# EAGLE design Phase 3.1. Form Factor 3 (EAGLE 9.6.2)
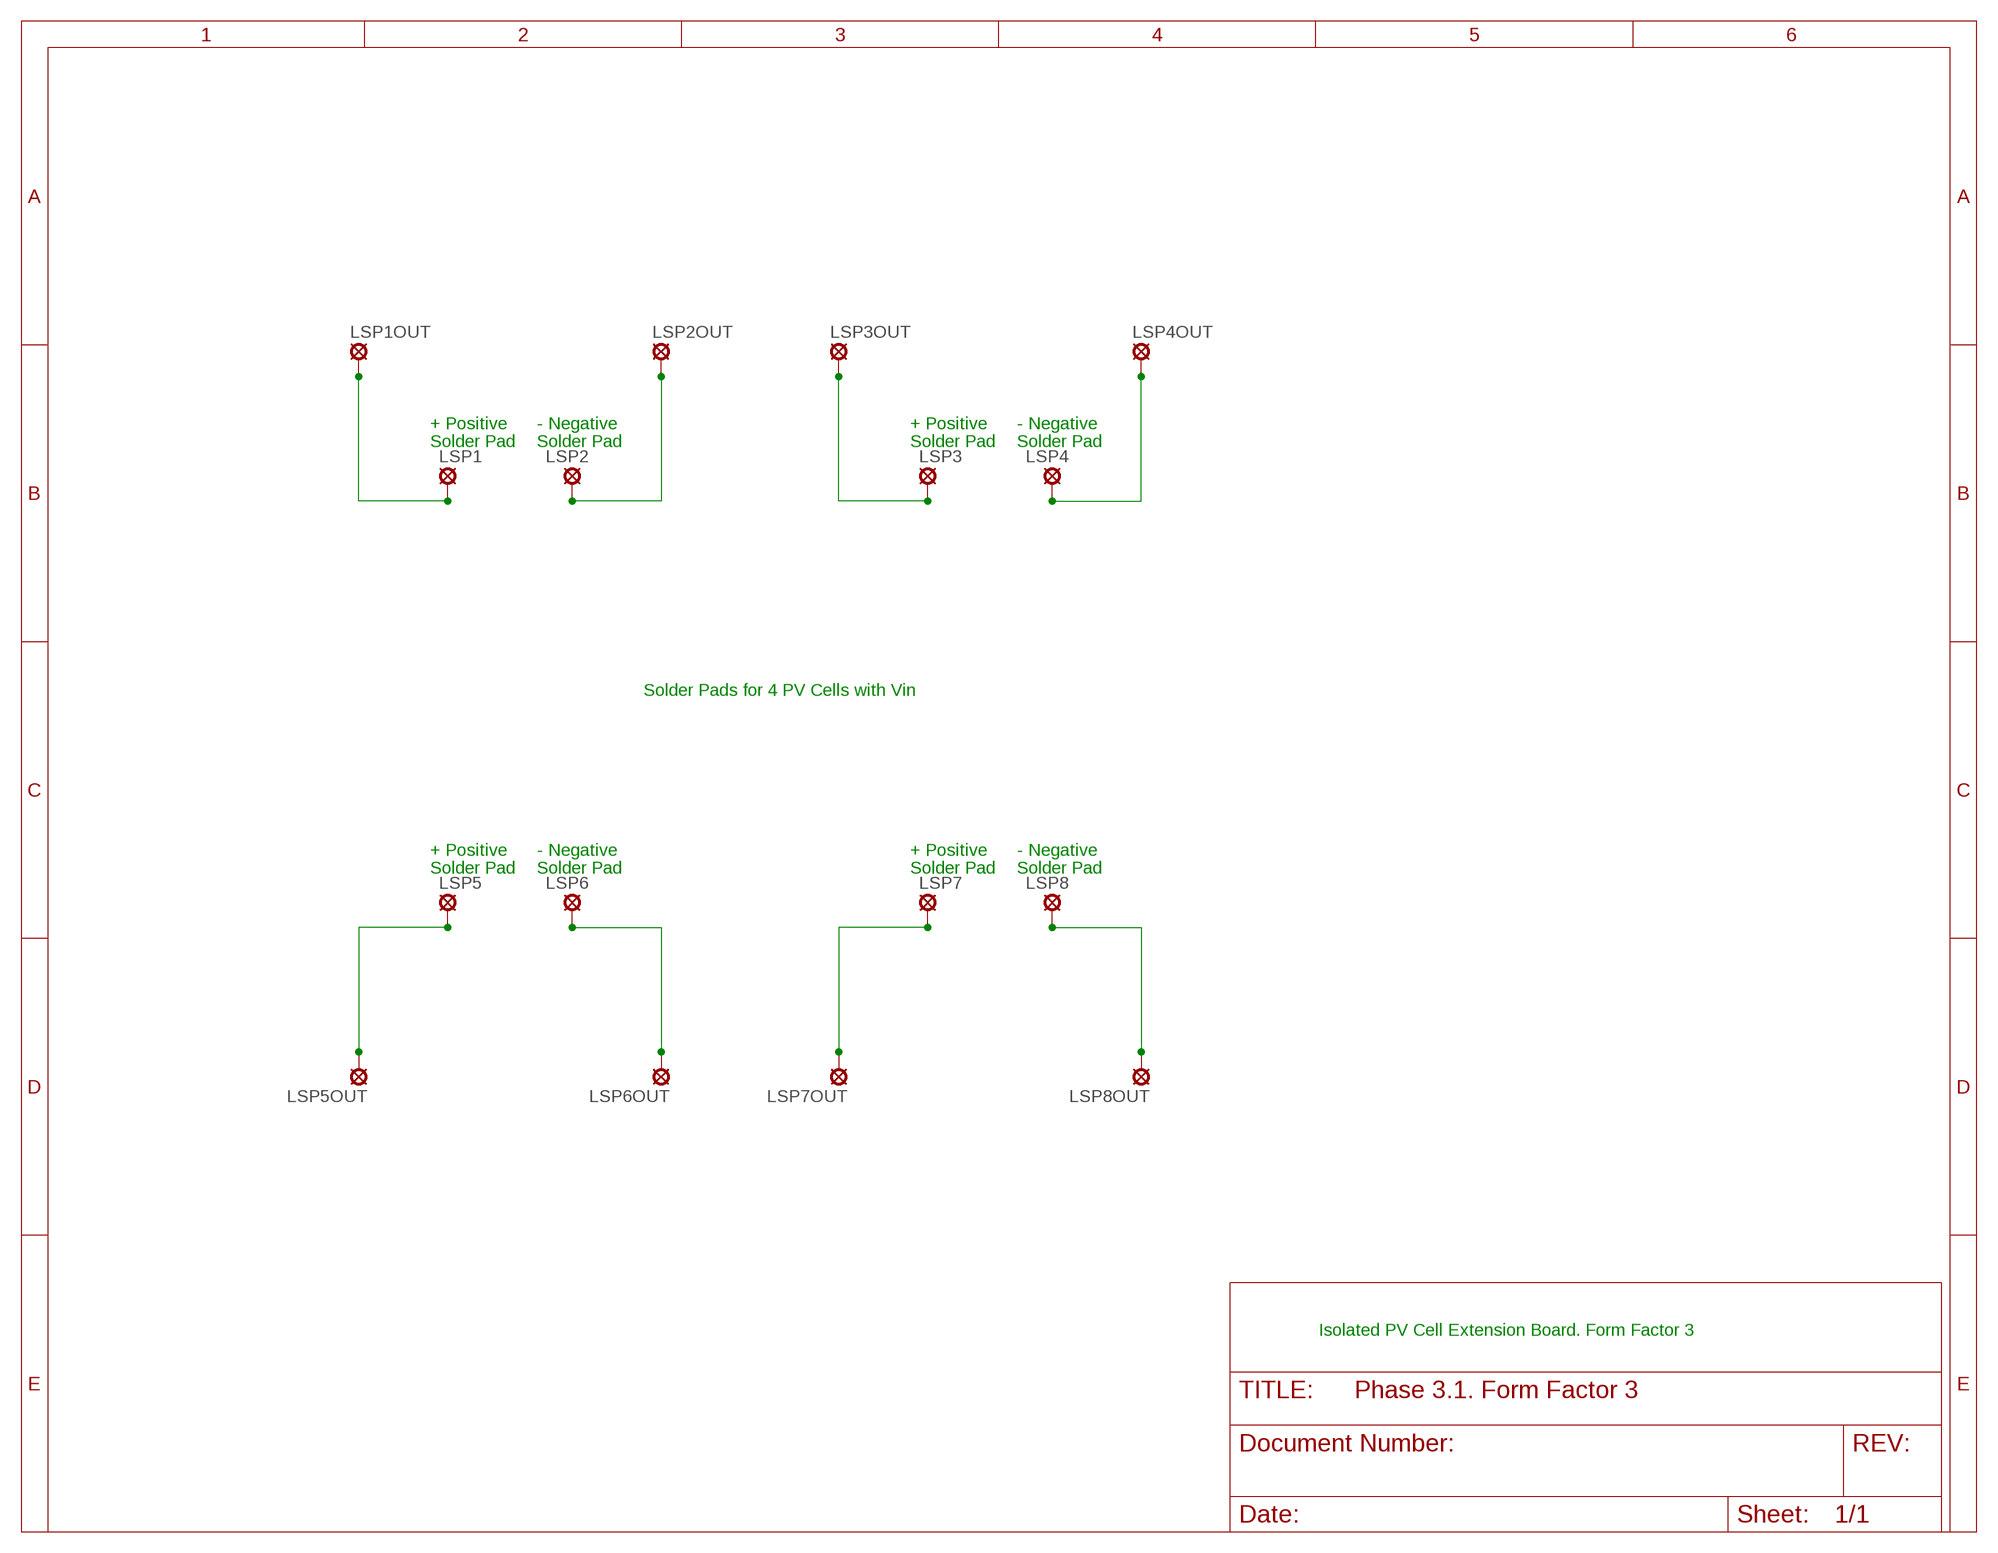
[diagram p0: schematic, sheet 1]

## Parts
LSP1  LSP10  [LSP10]
LSP1OUT  LSP10  [LSP10]
LSP2  LSP10  [LSP10]
LSP2OUT  LSP10  [LSP10]
LSP3  LSP10  [LSP10]
LSP3OUT  LSP10  [LSP10]
LSP4  LSP10  [LSP10]
LSP4OUT  LSP10  [LSP10]
LSP5  LSP10  [LSP10]
LSP5OUT  LSP10  [LSP10]
LSP6  LSP10  [LSP10]
LSP6OUT  LSP10  [LSP10]
LSP7  LSP10  [LSP10]
LSP7OUT  LSP10  [LSP10]
LSP8  LSP10  [LSP10]
LSP8OUT  LSP10  [LSP10]

## Nets
N$1: LSP1.MP LSP1OUT.MP
N$2: LSP2.MP LSP2OUT.MP
N$3: LSP3.MP LSP3OUT.MP
N$4: LSP4.MP LSP4OUT.MP
N$5: LSP5.MP LSP5OUT.MP
N$6: LSP6.MP LSP6OUT.MP
N$7: LSP7.MP LSP7OUT.MP
N$8: LSP8.MP LSP8OUT.MP

## Notes on the sheet
- + Positive | - Negative | + Positive | - Negative
- Solder Pad | Solder Pad | Solder Pad | Solder Pad
- Solder Pads for 4 PV Cells with Vin
- + Positive | - Negative | + Positive | - Negative
- Solder Pad | Solder Pad | Solder Pad | Solder Pad
- Isolated PV Cell Extension Board. Form Factor 3

## Library data of the parts
LSP1 LSP1OUT LSP2 LSP2OUT LSP3 LSP3OUT LSP4 LSP4OUT LSP5 LSP5OUT LSP6 LSP6OUT LSP7 LSP7OUT LSP8 LSP8OUT = solpad:LSP10: SOLDER PAD drill 1.0 mm, distributor Buerklin, 12H555

## Board
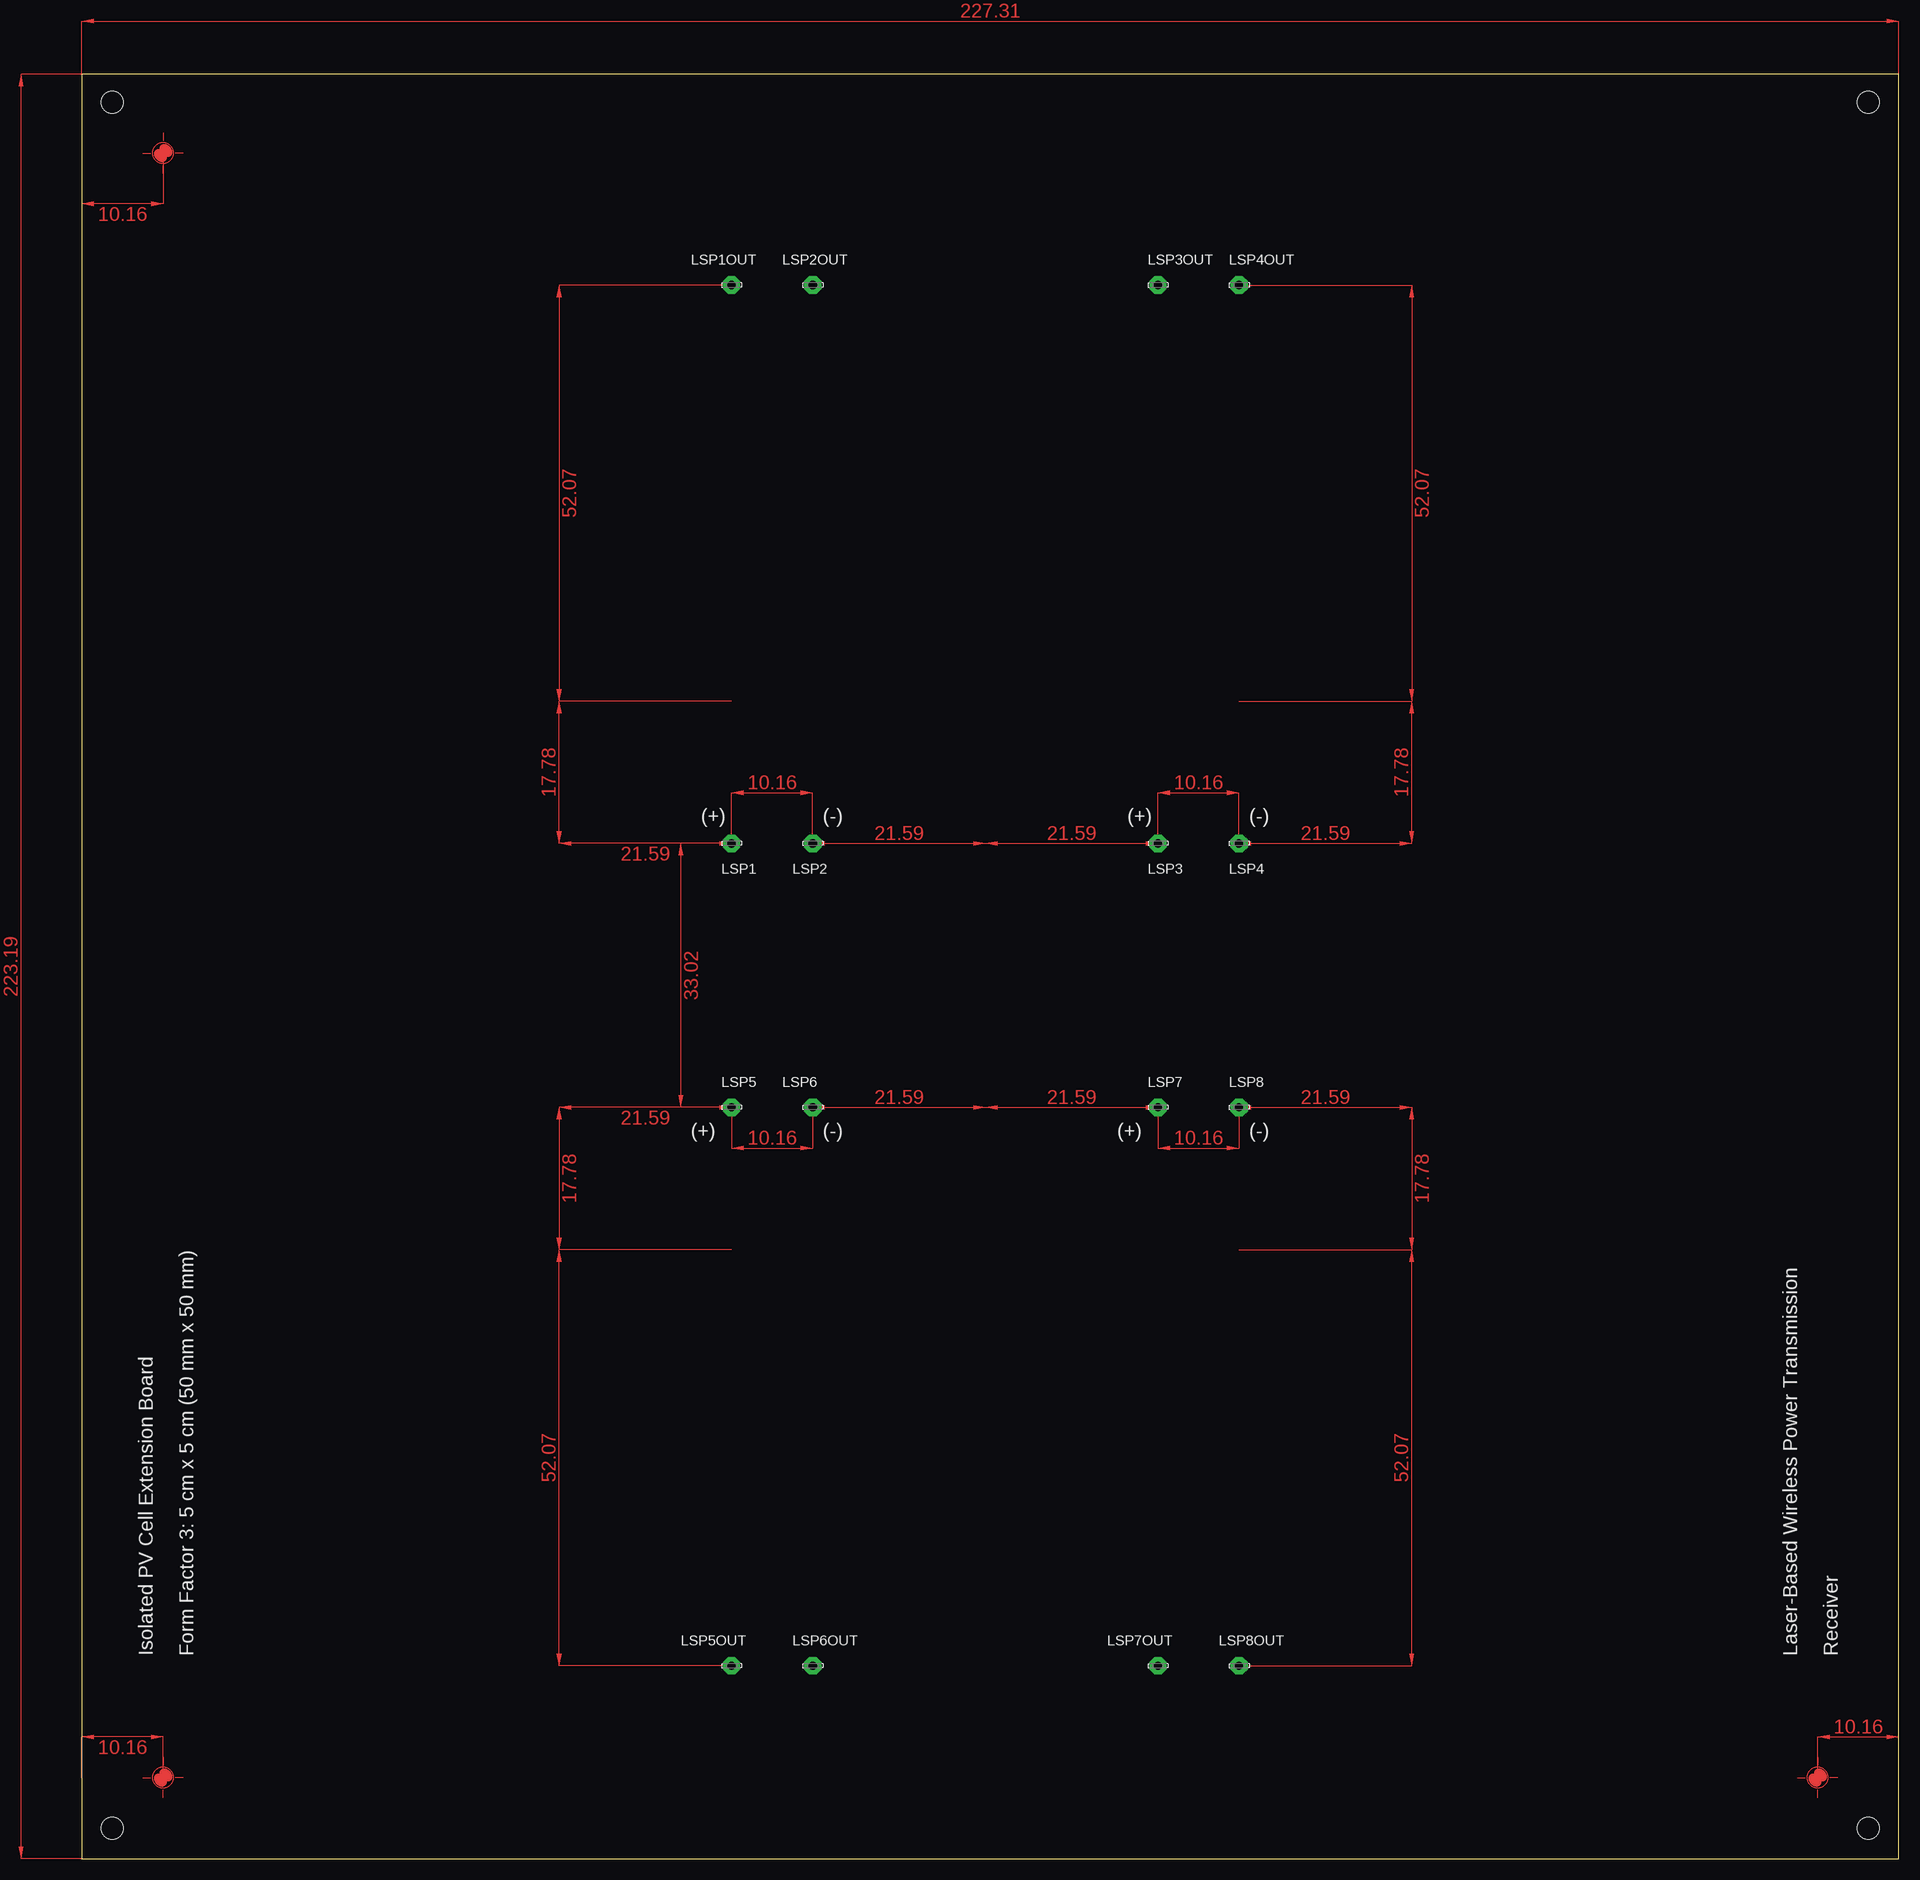
[diagram p1: board, top side]
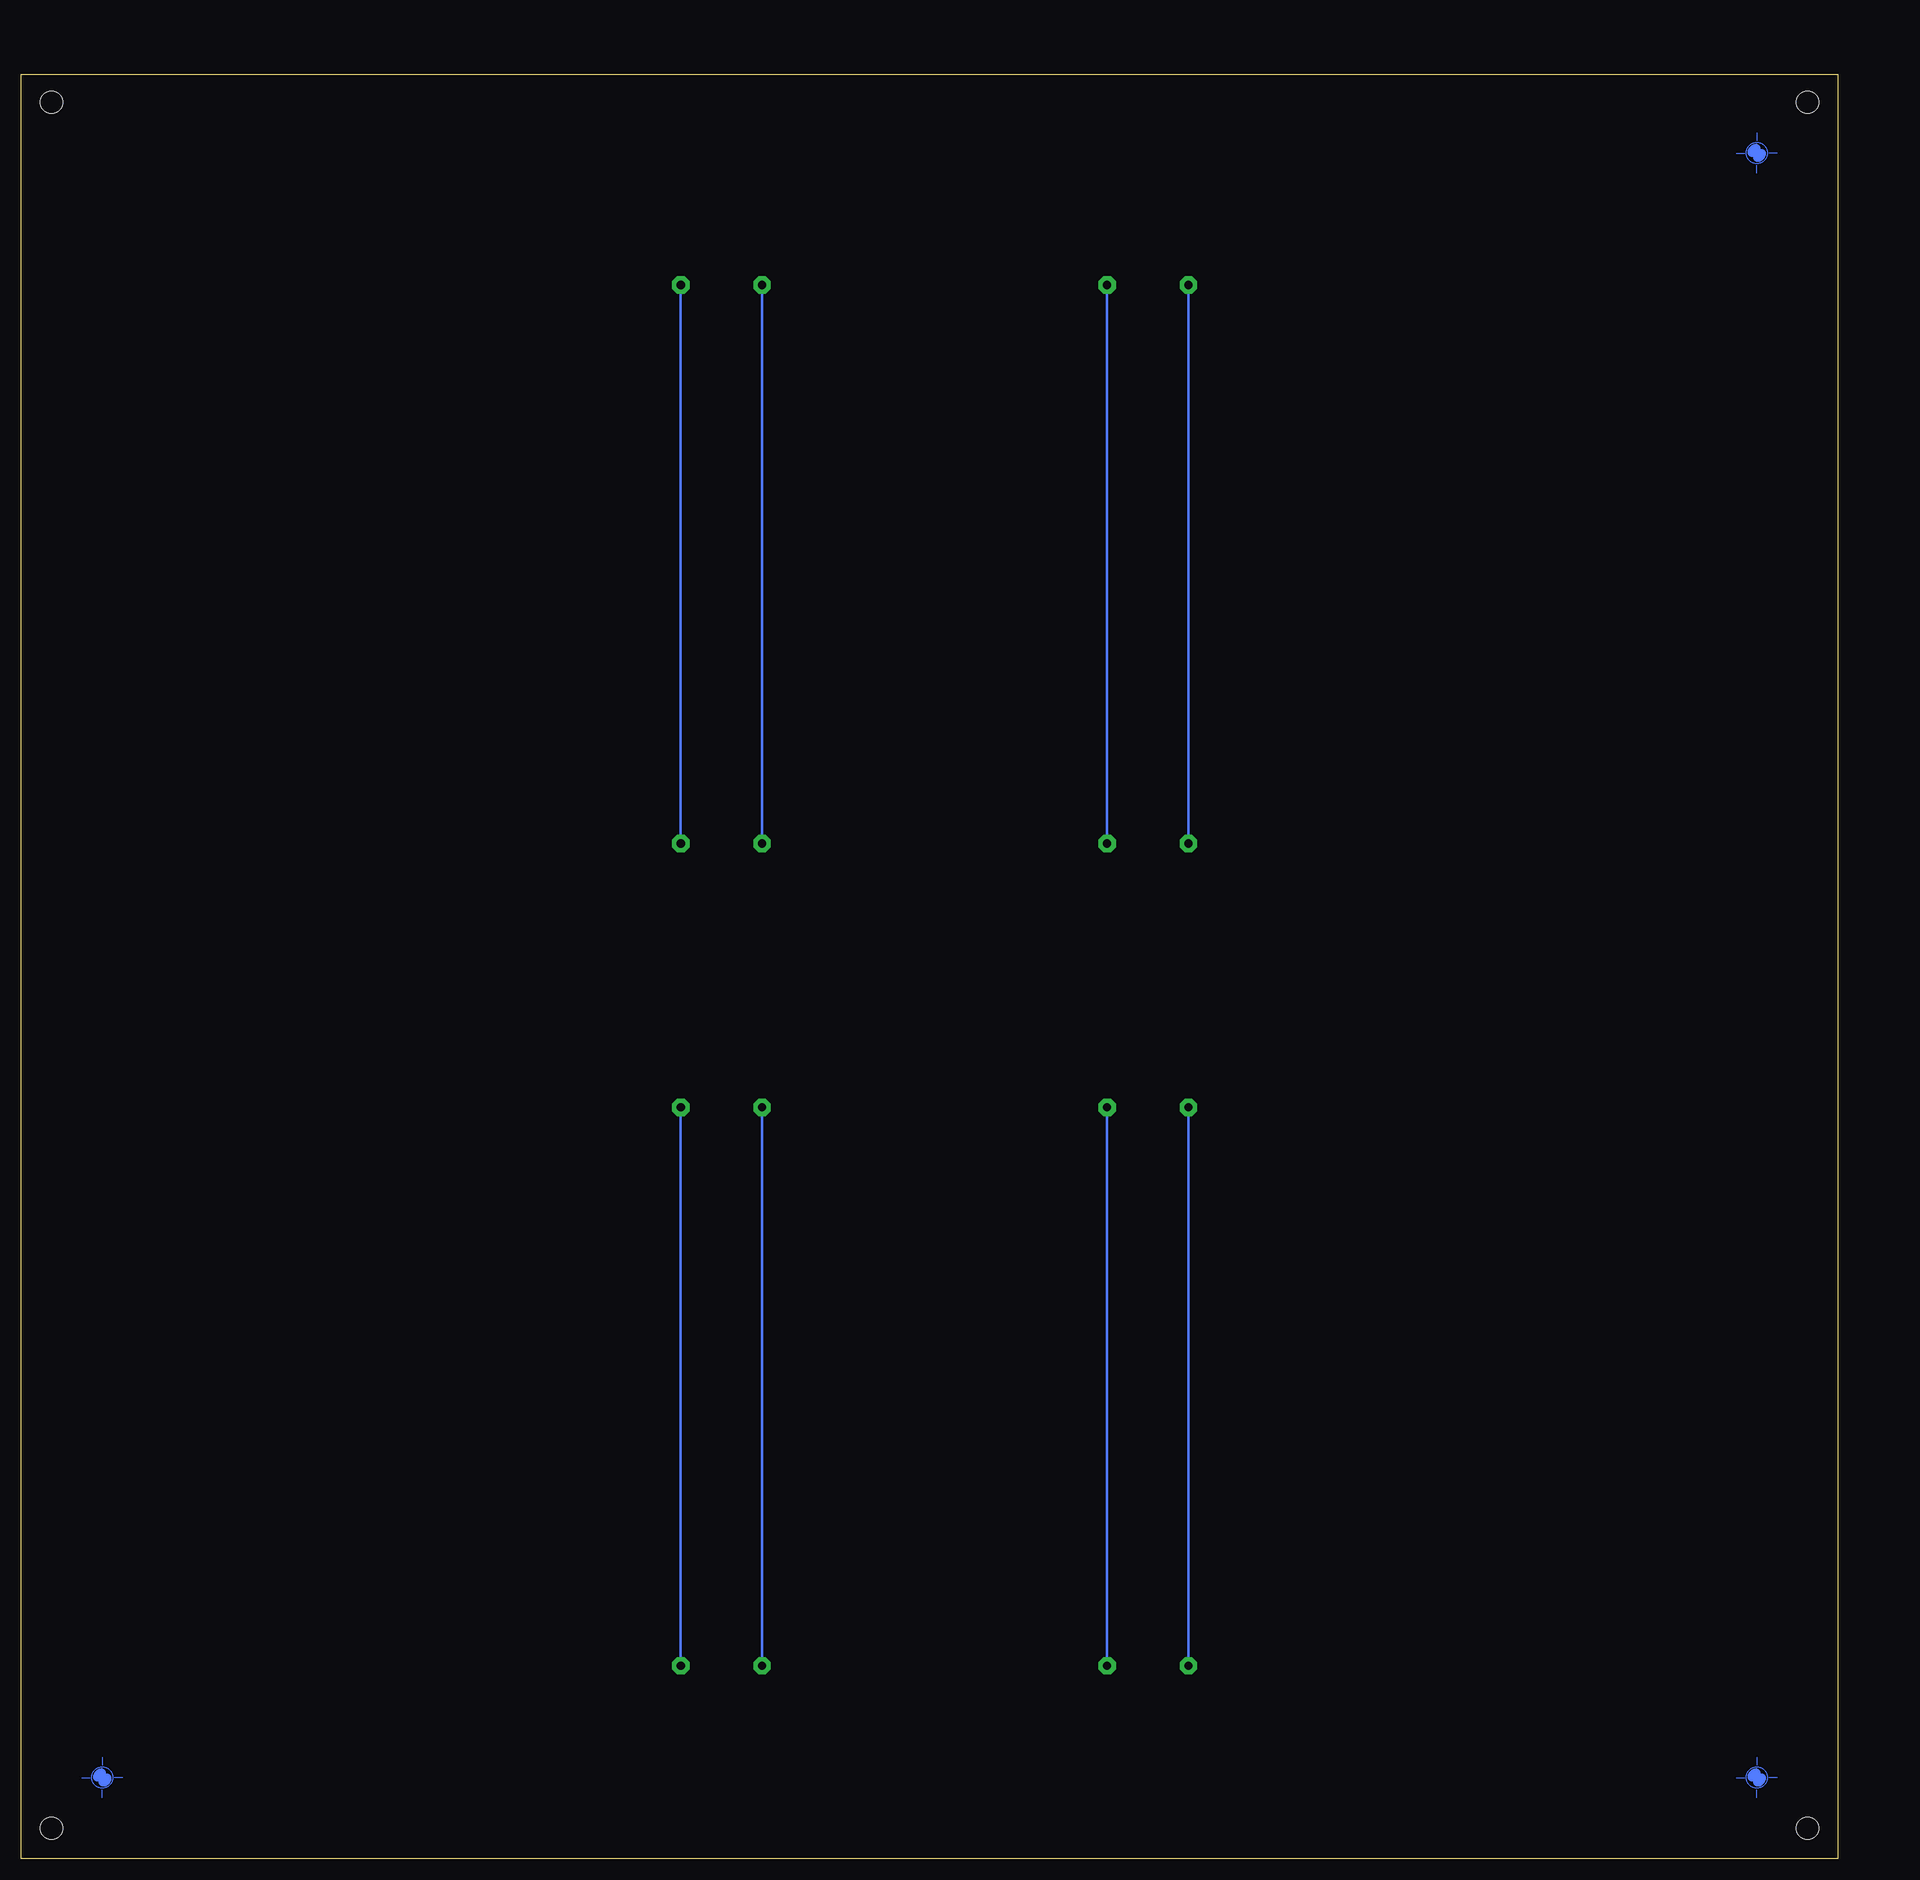
[diagram p2: board, bottom side, seen from below]

Size 227.31 x 223.19 mm. Coordinates in mm from the lower left corner, seen from the top.
Outline: 0,0 227.31,0 227.31,223.19 0,223.19 0,0
Copper layers (1*16): Top 0.035mm / dielectric 1.5mm / Bottom 0.035mm
Design rules "default": minimum track width 6mil, minimum drill 0.35mm, track to track 6mil, track to pad 6mil, pad to pad 6mil, via to via 6mil, smd to smd 6mil, copper to edge 40mil, drill to drill 6mil, minimum pad ring 10mil, minimum via ring 8mil, stop-mask expansion 4mil, vias tented up to drill 0mil, thermal gap 10mil

### Footprints (pad centres in the part's own frame; a part is rotated, then mirrored left to right if it is on the bottom)
LSP10 = drill 1.016 pad 2.159 octagon: MP 0,0
MOUNTHOLE_110MIL = hole 2.794: 0,0

### Placement (x,y rotation side)
LSP1  81.28,127 0 top
LSP1OUT  81.28,196.85 0 top
LSP2  91.44,127 0 top
LSP2OUT  91.44,196.85 0 top
LSP3  134.62,127 0 top
LSP3OUT  134.62,196.85 0 top
LSP4  144.78,127 0 top
LSP4OUT  144.78,196.85 0 top
LSP5  81.28,93.98 0 top
LSP5OUT  81.28,24.13 0 top
LSP6  91.44,93.98 0 top
LSP6OUT  91.44,24.13 0 top
LSP7  134.62,93.98 0 top
LSP7OUT  134.62,24.13 0 top
LSP8  144.78,93.98 0 top
LSP8OUT  144.78,24.13 0 top
STAND1  [MOUNTHOLE_110MIL]  3.81,3.81 0 top
STAND2  [MOUNTHOLE_110MIL]  223.52,219.71 0 top
STAND3  [MOUNTHOLE_110MIL]  223.52,3.81 0 top
STAND4  [MOUNTHOLE_110MIL]  3.81,219.71 0 top
U$1  [PASS-ROUND]  10.16,213.36 0 top
U$2  [PASS-ROUND]  10.16,10.16 0 top
U$3  [PASS-ROUND]  217.17,10.16 0 top

### Tracks (layer width: path | path; a pad name or v marks a point on that pad's centre or on a via)
N$1
  Bottom 0.305: LSP1OUT.MP LSP1.MP
N$2
  Bottom 0.152: 91.49,127 LSP2.MP | 91.49,196.8 LSP2OUT.MP
  Bottom 0.305: 91.49,196.8 91.49,127
N$3
  Bottom 0.305: LSP3OUT.MP LSP3.MP
N$4
  Bottom 0.152: 144.83,127 LSP4.MP | 144.83,196.8 LSP4OUT.MP
  Bottom 0.305: 144.83,196.8 144.83,127
N$5
  Bottom 0.305: LSP5.MP LSP5OUT.MP
N$6
  Bottom 0.152: 91.49,24.13 LSP6OUT.MP | 91.49,93.93 LSP6.MP
  Bottom 0.305: 91.49,93.93 91.49,24.13
N$7
  Bottom 0.305: LSP7.MP LSP7OUT.MP
N$8
  Bottom 0.152: 144.83,24.13 LSP8OUT.MP | 144.83,93.93 LSP8.MP
  Bottom 0.305: 144.83,93.93 144.83,24.13
(copper drawn outside any net)
  shapes: Top area x26

### Text on the board
tNames: (+) | (-) | (+) | (-) | (+) | (-) | (+) | (-) | Isolated PV Cell Extension Board | Form Factor 3: 5 cm x 5 cm (50 mm x 50 mm) | Laser-Based Wireless Power Transmission | Receiver